# EAGLE design relay_shield_v1 (EAGLE 6.3)
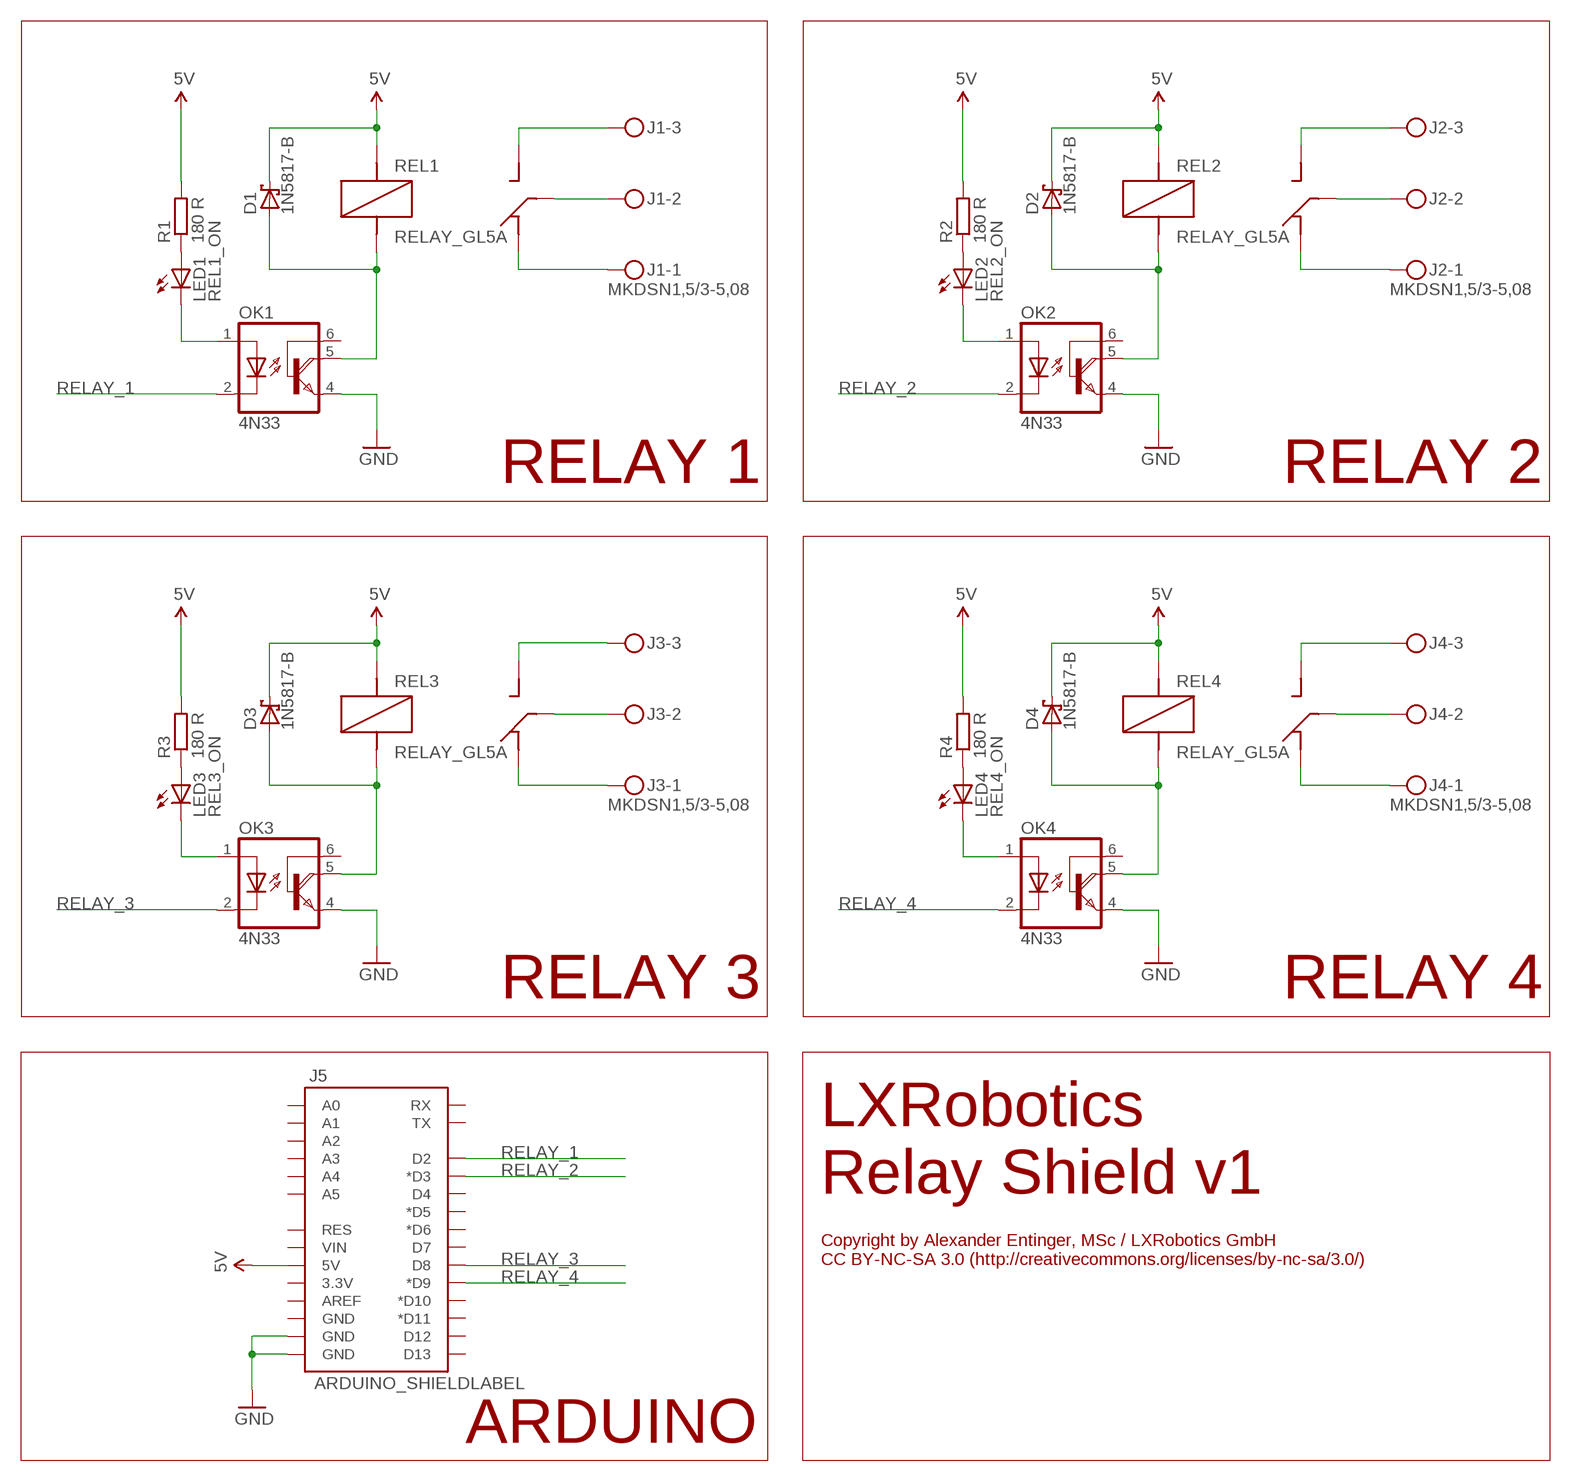
[diagram p0: schematic, sheet 1]

## Parts
D1  1N5817-B  [DO41-7.6]
D2  1N5817-B  [DO41-7.6]
D3  1N5817-B  [DO41-7.6]
D4  1N5817-B  [DO41-7.6]
J1  MKDSN1,5/3-5,08  [MKDSN1,5/3-5,08]
J2  MKDSN1,5/3-5,08  [MKDSN1,5/3-5,08]
J3  MKDSN1,5/3-5,08  [MKDSN1,5/3-5,08]
J4  MKDSN1,5/3-5,08  [MKDSN1,5/3-5,08]
J5  ARDUINO_SHIELDLABEL  [DUEMILANOVE_SHIELD]
LED1  REL1_ON  LED5MM  [LED5MM]
LED2  REL2_ON  LED5MM  [LED5MM]
LED3  REL3_ON  LED5MM  [LED5MM]
LED4  REL4_ON  LED5MM  [LED5MM]
OK1  4N33  [DIL06]
OK2  4N33  [DIL06]
OK3  4N33  [DIL06]
OK4  4N33  [DIL06]
R1  180 R  R-EU_0204/7  [0204/7]
R2  180 R  R-EU_0204/7  [0204/7]
R3  180 R  R-EU_0204/7  [0204/7]
R4  180 R  R-EU_0204/7  [0204/7]
REL1  RELAY_GL5A  [RELAY_GL5A]
REL2  RELAY_GL5A  [RELAY_GL5A]
REL3  RELAY_GL5A  [RELAY_GL5A]
REL4  RELAY_GL5A  [RELAY_GL5A]

## Nets
5V: D1.C D2.C D3.C D4.C J5.5V R1.2 R2.2 R3.2 R4.2 REL1.R2(R2_COIL1) REL2.R2(R2_COIL1) REL3.R2(R2_COIL1) REL4.R2(R2_COIL1)
GND: J5.GND@0(GND) J5.GND@1(GND) OK1.4(E) OK2.4(E) OK3.4(E) OK4.4(E)
N$1: D1.A OK1.5(COL) REL1.R5(R5_COIL2)
N$2: J1.2 REL1.R1(R1_COMMON)
N$3: J1.1 REL1.R4(R4_SW)
N$4: LED1.K(C) OK1.1(A)
N$6: LED1.A R1.1
N$7: J1.3 REL1.R3(R3_SW)
N$8: D2.A OK2.5(COL) REL2.R5(R5_COIL2)
N$9: LED2.K(C) OK2.1(A)
N$11: LED2.A R2.1
N$12: J2.2 REL2.R1(R1_COMMON)
N$13: J2.1 REL2.R4(R4_SW)
N$14: J2.3 REL2.R3(R3_SW)
N$15: D3.A OK3.5(COL) REL3.R5(R5_COIL2)
N$16: LED3.K(C) OK3.1(A)
N$18: LED3.A R3.1
N$19: J3.2 REL3.R1(R1_COMMON)
N$20: J3.1 REL3.R4(R4_SW)
N$21: J3.3 REL3.R3(R3_SW)
N$22: D4.A OK4.5(COL) REL4.R5(R5_COIL2)
N$23: LED4.K(C) OK4.1(A)
N$25: LED4.A R4.1
N$26: J4.2 REL4.R1(R1_COMMON)
N$27: J4.1 REL4.R4(R4_SW)
N$28: J4.3 REL4.R3(R3_SW)
RELAY_1: J5.D2 OK1.2(C)
RELAY_2: J5.D3(*D3) OK2.2(C)
RELAY_3: J5.D8 OK3.2(C)
RELAY_4: J5.D9(*D9) OK4.2(C)
Unconnected: J5.3.3V J5.A0 J5.A1 J5.A2 J5.A3 J5.A4 J5.A5 J5.AREF J5.D4 J5.D5(*D5) J5.D6(*D6) J5.D7 J5.D10(*D10) J5.D11(*D11) J5.D12 J5.D13 J5.GND@2(GND) J5.RES J5.RX J5.TX J5.VIN OK1.6(B) OK2.6(B) OK3.6(B) OK4.6(B)

## Notes on the sheet
- RELAY 1 | RELAY 2
- RELAY 3 | RELAY 4
- LXRobotics
  Relay Shield v1
- Copyright by Alexander Entinger, MSc / LXRobotics GmbH 
  CC BY-NC-SA 3.0 (http://creativecommons.org/licenses/by-nc-sa/3.0/)
- ARDUINO

## Library data of the parts
D1-D4 = diode:1N581*: 1.0A SCHOTTKY BARRIER RECTIFIER Source: http://www.diodes.com/datasheets/ds23001.pdf
J1-J4 = con-phoenix-508:MKDSN1,5/3-5,08: MKDSN 1,5/ 3-5,08 Printklemme Nennstrom: 13,5 A Nennspannung: 250 V Rastermaß: 5,08 mm Polzahl: 3 Anschlussart: Schraubanschluss Montage: Löten Anschlussrichtung Leiter/Platine: 0 ° Artikelnummer: 1729131 Source: http://eshop.phoenixcontact.com .. 1729131.pdf; MPN: SMKDSN1,5/3-5,08; OC_FARNELL: 1792904; OC_NEWARK: 70R0299
J5 = SparkFun-Boards:ARDUINO_SHIELD: Arduino shield footprint
LED1-LED4 = SparkFun-LED:LED: LEDs Standard schematic elements and footprints for 5mm, 3mm, 1206, and 0603 sized LEDs. 5mm - Spark Fun Electronics SKU : COM-00529 (and others)
OK1-OK4 = optocoupler:4N33: MOTOROLA OPTO COUPLER; MF: VISHAY/TELEFUNKEN; MPN: 4N33; OC_FARNELL: 1469601; OC_NEWARK: 88K1390
R1-R4 = resistor:R-EU_: RESISTOR, European symbol
REL1-REL4 = lxrobotics:RELAY_GL5A

## Board
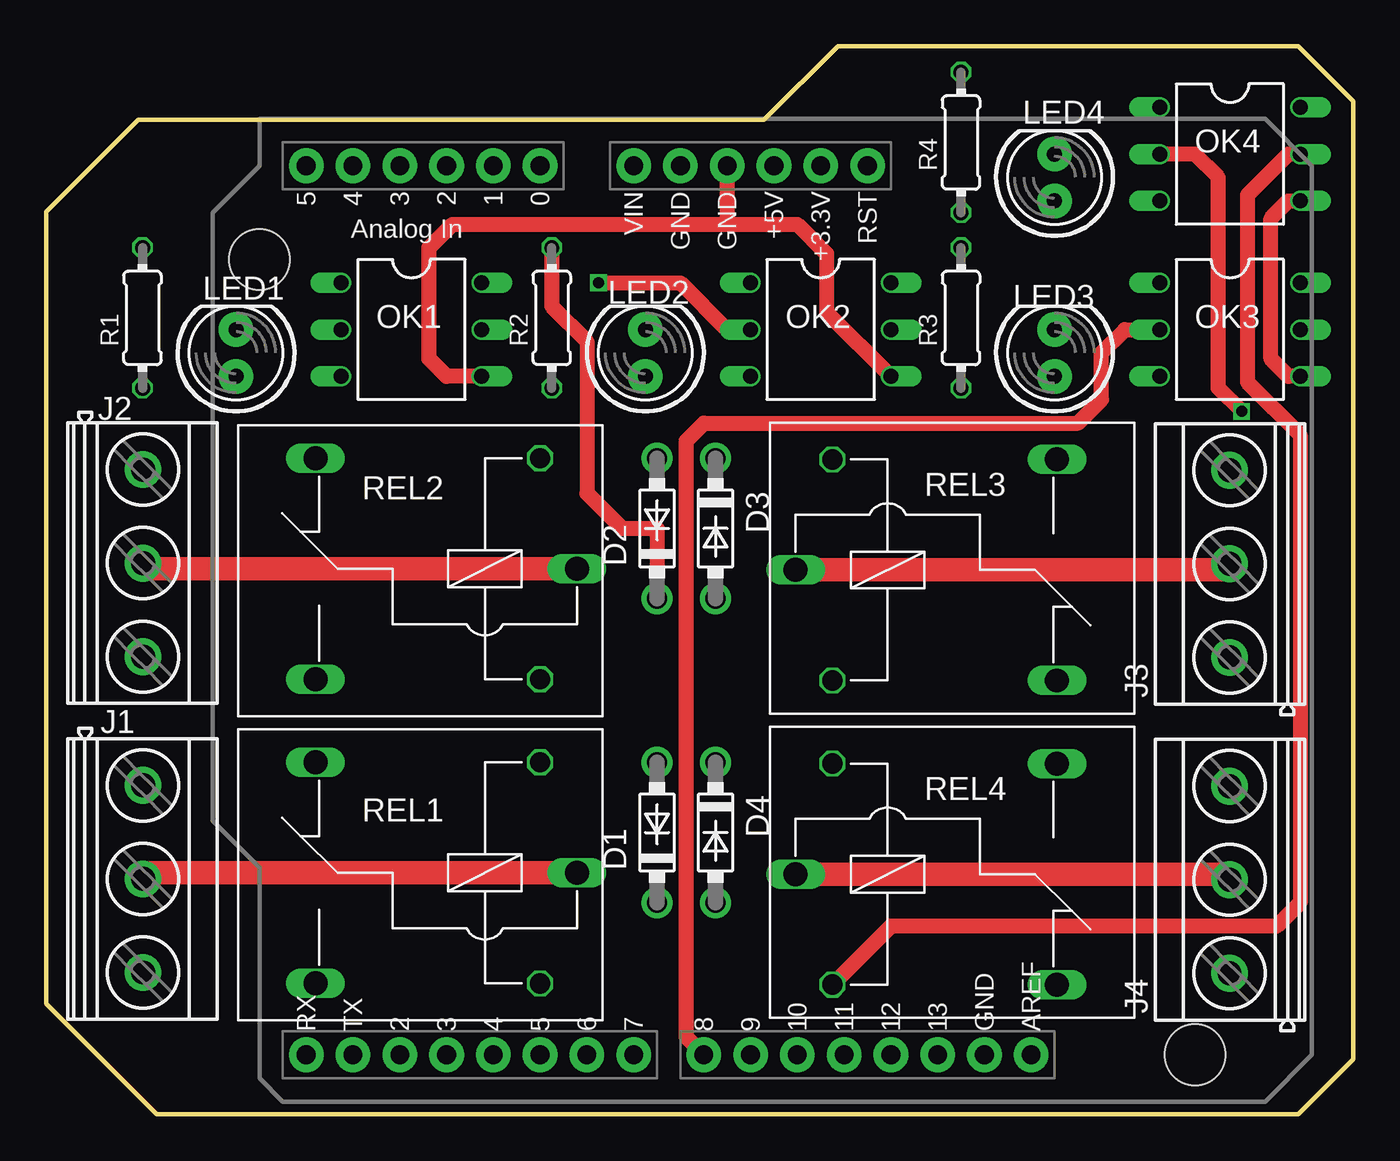
[diagram p1: board, top side]
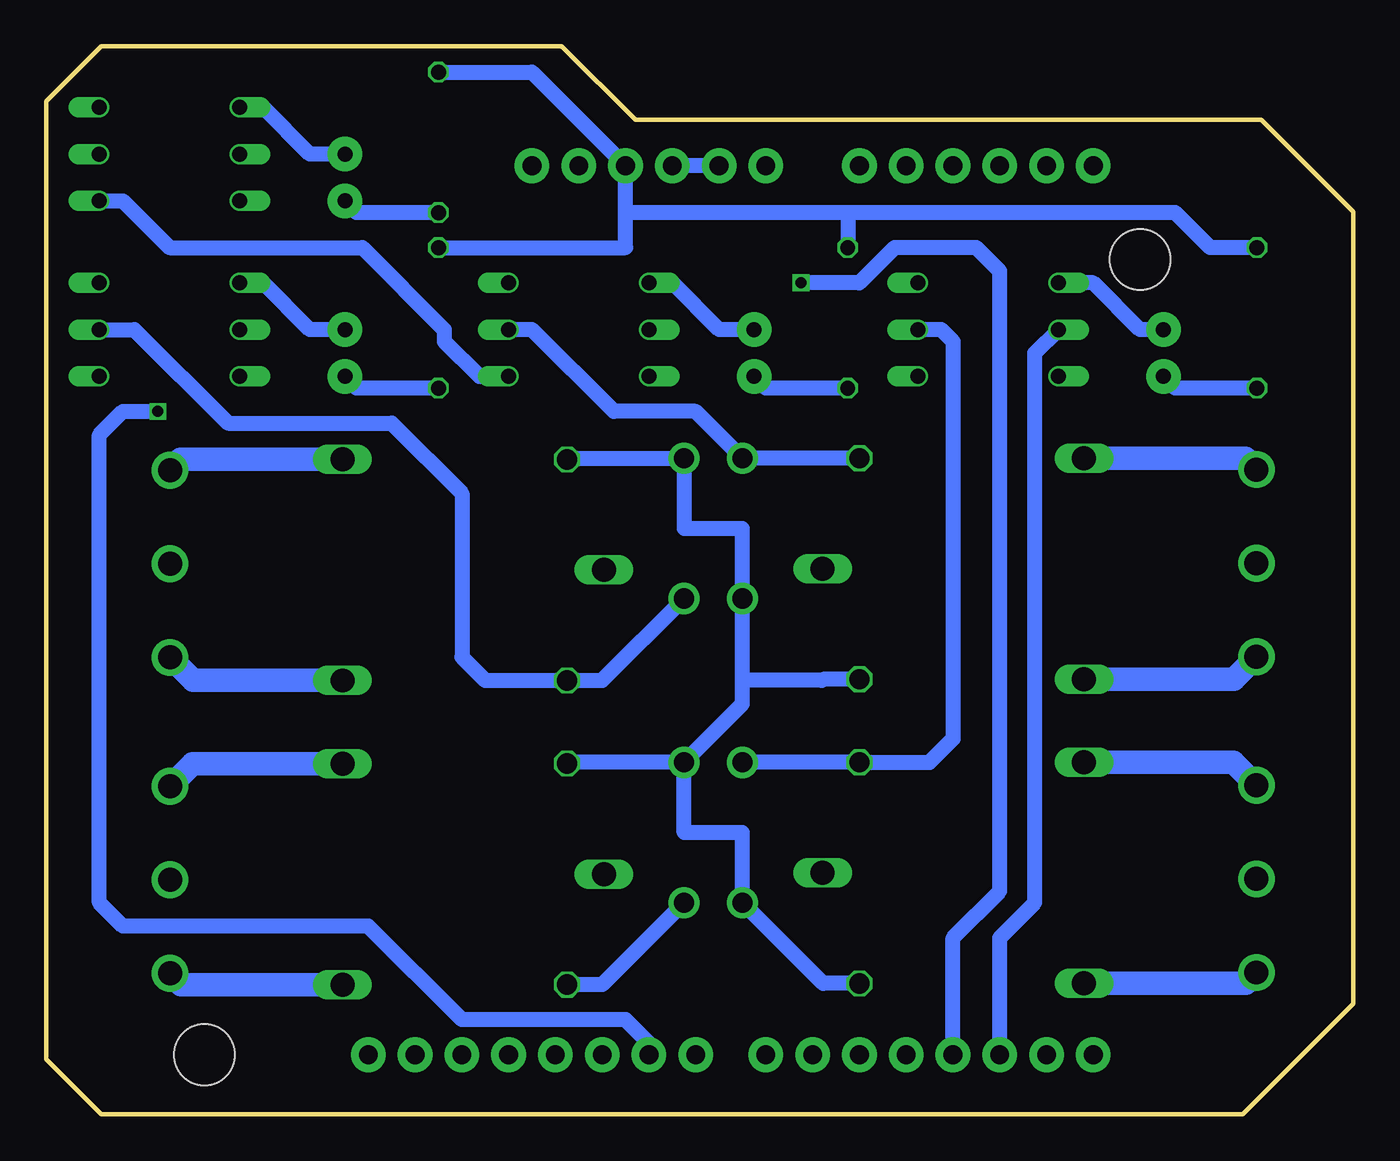
[diagram p2: board, bottom side, seen from below]

Size 71 x 58 mm. Coordinates in mm from the lower left corner, seen from the top.
Outline: 68,0 71,3 71,55 68,58 43,58 39,54 5,54 0,49 0,6 6,0 68,0
Copper layers (1*16): Top 0.035mm / dielectric 1.5mm / Bottom 0.035mm
Design rules "LeitOn - Standard-Eagle-DRU - 1- und  2-Lagen DK - deutsch - Rev 2.0": minimum track width 0.15mm, minimum drill 0.3mm, track to track 0.15mm, track to pad 0.15mm, pad to pad 0.15mm, via to via 0.15mm, smd to smd 0.15mm, copper to edge 0.3mm, drill to drill 0.3mm, minimum pad ring 0.15mm, minimum via ring 0.15mm, stop-mask expansion 0.075mm, vias tented up to drill 0mil, thermal gap 0.2mm

### Footprints (pad centres in the part's own frame; a part is rotated, then mirrored left to right if it is on the bottom)
DO41-7.6 = drill 1.1 pad 1.7: A 3.81,0; C -3.81,0
MKDSN1,5/3-5,08 = drill 1.3 pad 2: 1 -7.641,0.025; 2 -2.561,0.025; 3 2.519,0.025
DUEMILANOVE_SHIELD = drill 1.016 pad 1.88: 3.3V 50.8,26.67; 5V 50.8,29.21; A0 50.8,41.91; A1 50.8,44.45; A2 50.8,46.99; A3 50.8,49.53; A4 50.8,52.07; A5 50.8,54.61; AREF 2.54,15.24; D2 2.54,49.53; D3 2.54,46.99; D4 2.54,44.45; D5 2.54,41.91; D6 2.54,39.37; D7 2.54,36.83; D8 2.54,33.02; D9 2.54,30.48; D10 2.54,27.94; D11 2.54,25.4; D12 2.54,22.86; D13 2.54,20.32; GND@0 50.8,31.75; GND@1 50.8,34.29; GND@2 2.54,17.78; RES 50.8,24.13; RX 2.54,54.61; TX 2.54,52.07; VIN 50.8,36.83 | hole 3.302: 45.72,57.15; 2.54,6.35
LED5MM = drill 0.813 pad 1.88: A -1.27,0; K 1.27,0
DIL06 = drill 0.813 offset: 1 -2.54,-3.81; 2 0,-3.81; 3 2.54,-3.81; 4 2.54,3.81; 5 0,3.81; 6 -2.54,3.81
0204/7 = drill 0.813 octagon: 1 -3.81,0; 2 3.81,0
RELAY_GL5A = drill 1.3 long: R1 -2,6; R3 12.2,12; R4 12.2,0 | drill 1.1 octagon: R2 0,12; R5 0,0

### Placement (x,y rotation side)
D1  33.18,15.3 90 top
D2  33.18,31.81 90 top
D3  36.35,31.81 270 top
D4  36.35,15.3 270 top
J1  5.24,10.23 270 top
J2  5.24,27.37 270 top
J3  64.3,32.45 90 top
J4  64.3,15.3 90 top
J5  68.74,0.7 90 top
LED1  10.32,41.34 90 top
LED2  32.55,41.34 90 top
LED3  54.77,41.34 90 top
LED4  54.77,50.87 90 top
OK1  19.84,42.61 270 top
OK2  42.07,42.61 270 top
OK3  64.3,42.61 270 top
OK4  64.3,52.14 270 top
R1  5.24,43.24 90 top
R2  27.47,43.24 90 top
R3  49.69,43.24 90 top
R4  49.69,52.77 90 top
REL1  26.83,19.11 180 top
REL2  26.83,35.62 180 top
REL3  42.7,23.56 0 top
REL4  42.7,7.05 0 top

### Tracks (layer width: path | path; a pad name or v marks a point on that pad's centre or on a via)
5V
  Top 0.813: R2.2 27.47,43.88 29.37,41.98 29.37,33.72 31.27,31.81 33.18,31.81 D2.C
  Bottom 0.813: REL1.R2 28.8,7.11 D1.C 33.18,15.3 36.35,15.3 D4.C | REL2.R2 28.8,23.62 28.87,23.56 33.18,23.56 | D4.C 42.64,19.11 REL4.R2 | REL3.R2 42.64,35.62 D3.C 36.35,31.81 33.18,31.81 D2.C 33.18,23.56 | D4.C 33.18,22.29 33.18,23.56 | R1.2 7.78,47.05 9.68,48.96 27.47,48.96 | 27.47,48.96 R2.2 | 27.47,48.96 39.53,48.96 | 39.53,48.96 J5.5V 44.61,56.58 R4.2 | R3.2 39.53,47.05 39.53,48.96
GND
  Top 0.813: OK1.4 21.75,40.07 20.8,41.02 20.8,47.05 22.07,48.33 36.99,48.33 | 36.99,48.33 40.8,48.33 42.39,46.74 42.39,43.56 OK2.4 | J5.GND@0 36.99,48.33 | OK3.4 67.47,40.07 66.52,41.02 66.52,48.64 67.47,49.59 OK4.4
  Bottom 0.813: J5.GND@1 J5.GND@0 | OK4.4 66.83,49.59 64.3,47.05 53.82,47.05 49.37,42.61 49.37,41.98 47.47,40.07 OK2.4
N$1
  Bottom 0.813: D1.A REL1.R5 23.02,19.11 21.75,20.38 21.75,41.98 22.38,42.61 OK1.5
N$2
  Top 1.27: REL1.R1 5.59,13.11 arc90 J1.2
N$3
  Bottom 1.27: REL1.R4 6.51,19.11 J1.1
N$4
  Bottom 0.813: LED1.K 11.59,42.61 14.13,45.15 OK1.1
N$6
  Bottom 0.813: R1.1 9.68,39.44 LED1.A
N$7
  Bottom 1.27: REL1.R3 5.86,7.11 J1.3
N$8
  Bottom 0.813: REL2.R5 D2.A 35.72,38.16 40.16,38.16 44.61,42.61 OK2.5
N$9
  Bottom 0.813: LED2.K 34.45,42.61 36.99,45.15 OK2.1
N$11
  Bottom 0.813: R2.1 31.91,39.44 LED2.A
N$12
  Top 1.27: REL2.R1 5.57,29.62 arc-90 J2.2
N$13
  Bottom 1.27: J2.1 5.88,35.62 REL2.R4
N$14
  Bottom 1.27: J2.3 6.49,23.62 REL2.R3
N$15
  Bottom 0.813: D3.A 40.8,23.56 REL3.R5 47.15,23.56 48.42,24.83 48.42,33.72 52.23,37.53 61.12,37.53 66.2,42.61 OK3.5
N$16
  Bottom 0.813: LED3.K 56.67,42.61 59.22,45.15 OK3.1
N$18
  Bottom 0.813: R3.1 54.14,39.44 LED3.A
N$19
  Top 1.27: REL3.R1 63.94,29.56 arc90 J3.2
N$20
  Bottom 1.27: REL3.R4 63.02,23.56 J3.1
N$21
  Bottom 1.27: REL3.R3 63.68,35.56 J3.3
N$22
  Top 0.813: OK4.5 67.47,52.14 65.25,49.91 65.25,39.75 68.11,36.9 68.11,11.5 66.83,10.23 45.88,10.23 REL4.R5
  Bottom 0.813: D4.A 40.8,7.05 REL4.R5
N$23
  Bottom 0.813: LED4.K 56.67,52.14 59.22,54.67 OK4.1
N$25
  Bottom 0.813: R4.1 54.14,48.96 LED4.A
N$26
  Top 1.27: REL4.R1 63.96,13.05 arc-90 J4.2
N$27
  Bottom 1.27: REL4.R4 63.66,7.05 J4.1
N$28
  Bottom 1.27: REL4.R3 63.04,19.05 J4.3
RELAY_1
  Bottom 0.813: J5.D2 19.21,9.59 17.3,11.5 17.3,41.34 OK1.2
RELAY_2  (via drill 0.6)
  Top 0.813: v30.01,45.15 34.45,45.15 36.99,42.61 OK2.2
  Bottom 0.813: J5.D3 21.75,9.59 19.21,12.13 19.21,45.78 20.48,47.05 24.92,47.05 26.83,45.15 v30.01,45.15
RELAY_3
  Top 0.813: J5.D8 34.77,4.19 34.77,36.58 35.72,37.53 56.04,37.53 57.31,38.8 57.31,41.34 58.58,42.61 OK3.2
RELAY_4  (via drill 0.6)
  Top 0.813: v64.93,38.16 63.66,39.44 63.66,50.87 62.39,52.14 OK4.2
  Bottom 0.813: J5.D9 38.26,3.88 39.53,5.14 48.42,5.14 53.5,10.23 66.83,10.23 68.11,11.5 68.11,36.9 66.83,38.16 v64.93,38.16